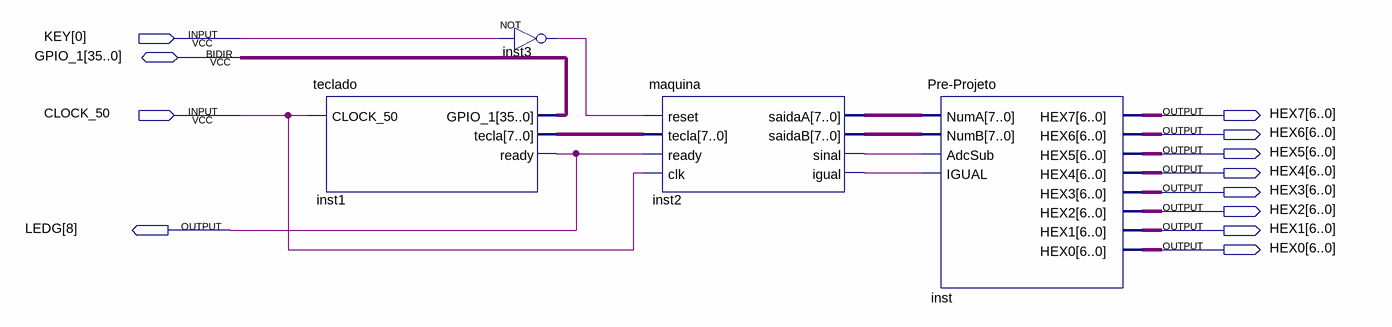
[diagram p0: schematic sheet]
// Quartus schematic Projeto.bdf as structural Verilog: 4 symbols, 12 pins
module Projeto (
  input  [0:0] KEY,
  input  CLOCK_50,
  inout  [35:0] GPIO_1,
  output [6:0] HEX7,
  output [6:0] HEX6,
  output [6:0] HEX5,
  output [6:0] HEX4,
  output [6:0] HEX3,
  output [6:0] HEX2,
  output [8:8] LEDG,
  output [6:0] HEX1,
  output [6:0] HEX0
);

  wire inst2_igual, inst2_sinal, inst3_out;
  wire [7:0] inst1_tecla, inst2_saidaa, inst2_saidab;

  teclado inst1 (.CLOCK_50(CLOCK_50), .tecla(inst1_tecla), .ready(LEDG[8]), .GPIO_1(GPIO_1));
  not inst3 (inst3_out, KEY[0]);
  maquina inst2 (
    .clk(CLOCK_50), .reset(inst3_out), .ready(LEDG[8]), .tecla(inst1_tecla), .saidaA(inst2_saidaa),
    .saidaB(inst2_saidab), .sinal(inst2_sinal), .igual(inst2_igual));
  \Pre-Projeto  inst (
    .IGUAL(inst2_igual), .NumA(inst2_saidaa), .NumB(inst2_saidab), .AdcSub(inst2_sinal), .HEX4(HEX4),
    .HEX5(HEX5), .HEX6(HEX6), .HEX7(HEX7), .HEX3(HEX3), .HEX2(HEX2), .HEX1(HEX1), .HEX0(HEX0));
endmodule
